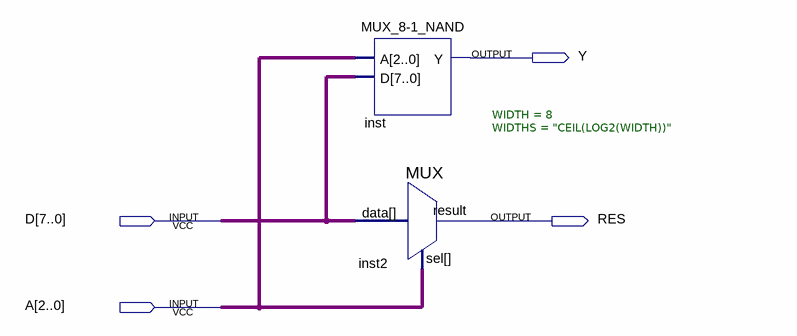
[diagram p0: schematic sheet]
// Quartus schematic L3_1_2.bdf as structural Verilog: 2 symbols, 4 pins
module L3_1_2 (
  input  [7:0] D,
  input  [2:0] A,
  output Y,
  output RES
);

  \MUX_8-1_NAND  inst (.A(A), .D(D), .Y(Y));
  MUX #(.WIDTH(8), .WIDTHS("CEIL(LOG2(WIDTH))")) inst2 (.data(D), .sel(A), .result(RES));
endmodule
